# EAGLE design RedditSecretSanta2020_2 (EAGLE 9.6.2)
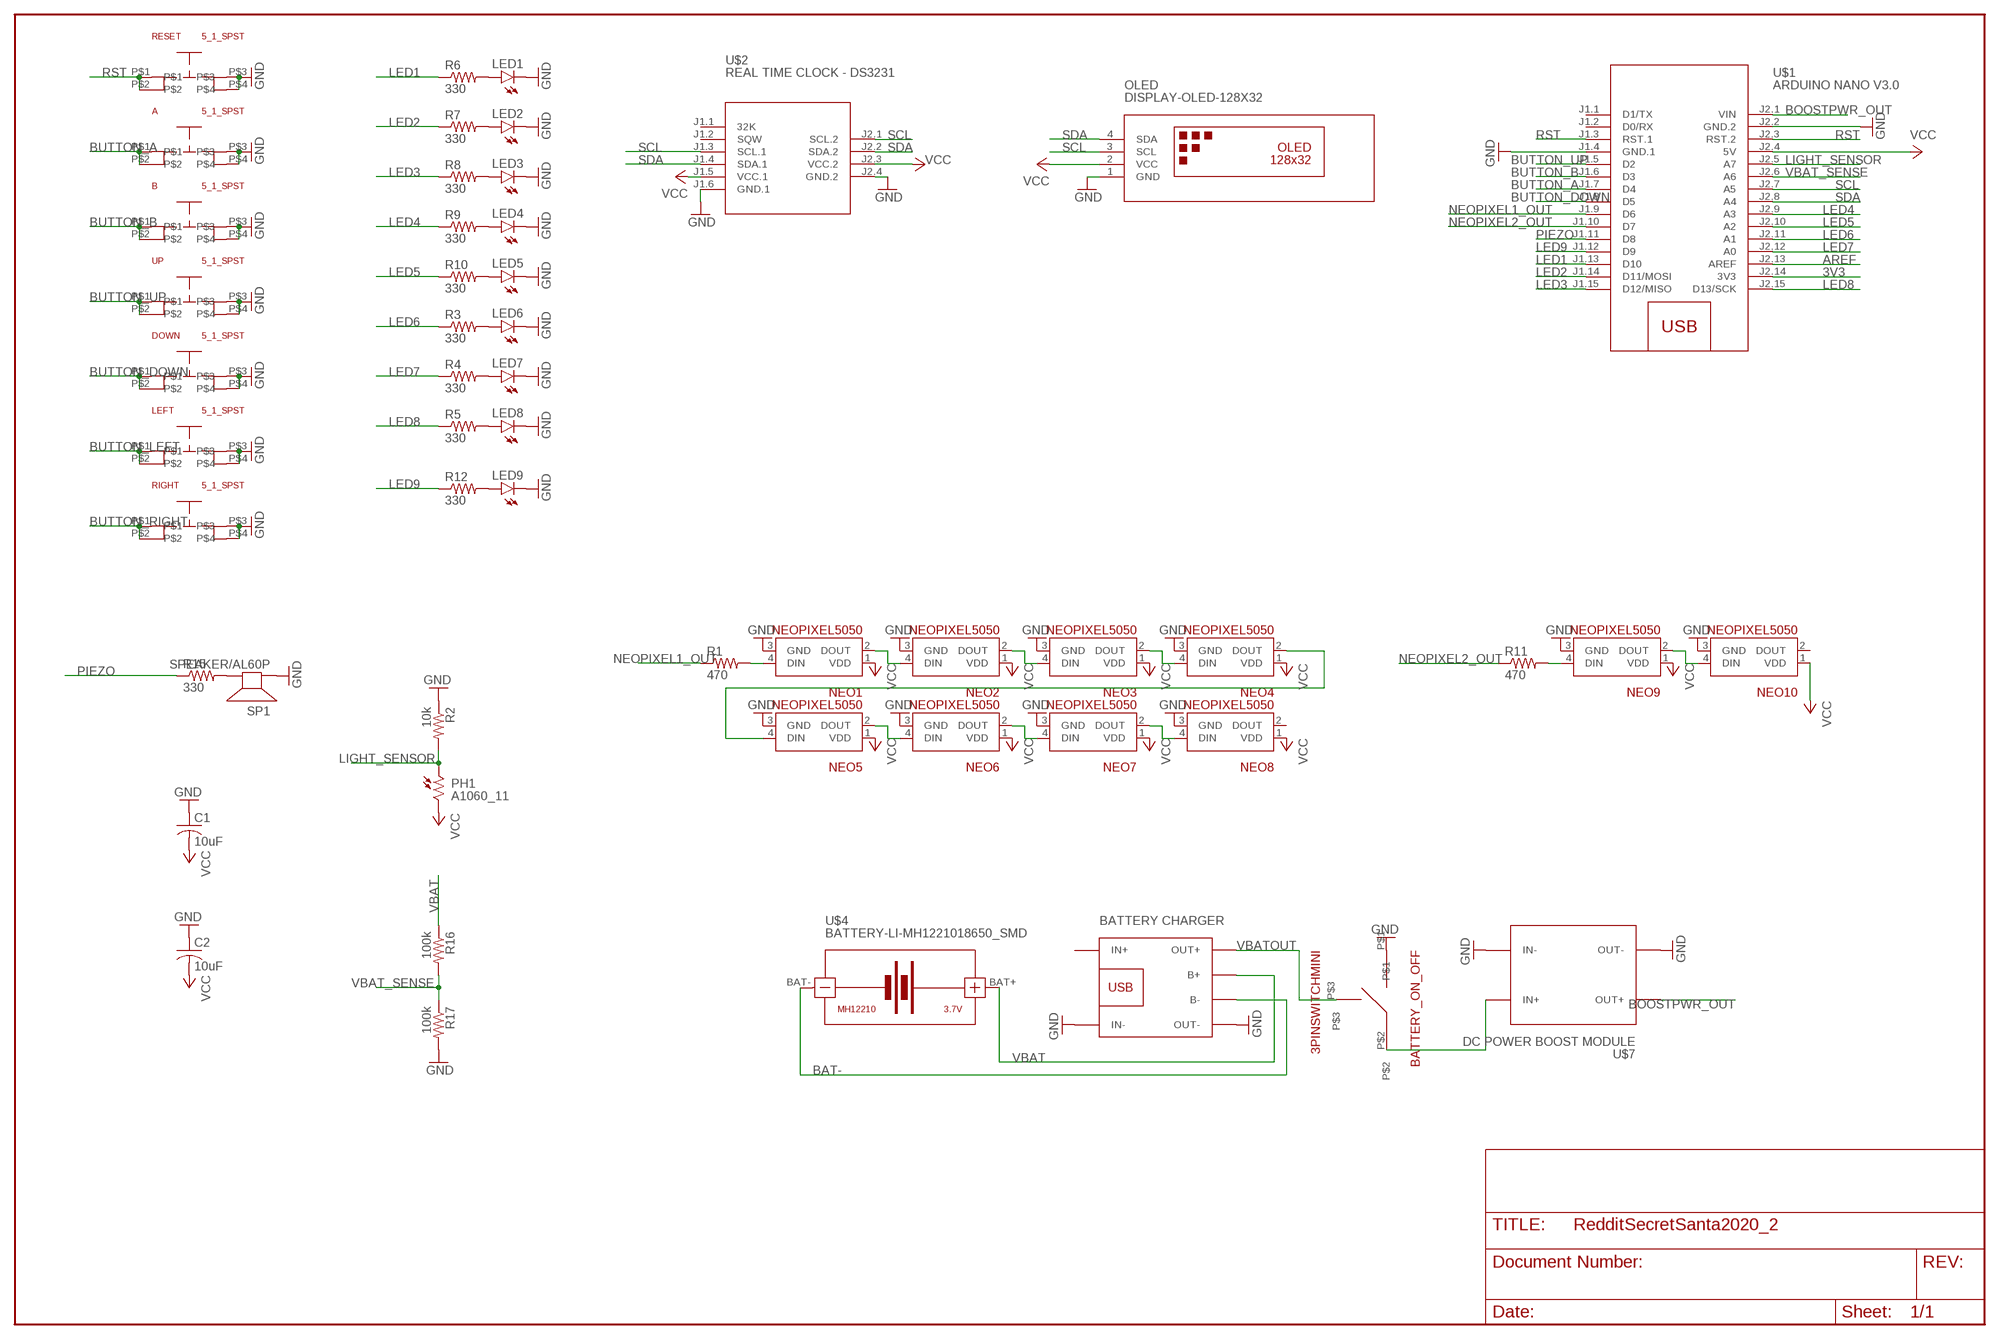
[diagram p0: schematic, sheet 1]

## Parts
A  5_1_SPST  [5_1_SPST]
B  5_1_SPST  [5_1_SPST]
BATTERY_ON_OFF  3PINSWITCHMINI  [3PINMINI]
C1  10uF  C-USC0805  [C0805]
C2  10uF  C-USC0805  [C0805]
DOWN  5_1_SPST  [5_1_SPST]
LED1  LEDSML0805  [SML0805]
LED2  LEDSML0805  [SML0805]
LED3  LEDSML0805  [SML0805]
LED4  LEDSML0805  [SML0805]
LED5  LEDSML0805  [SML0805]
LED6  LEDSML0805  [SML0805]
LED7  LEDSML0805  [SML0805]
LED8  LEDSML0805  [SML0805]
LED9  LEDSML0805  [SML0805]
LEFT  5_1_SPST  [5_1_SPST]
NEO1  NEOPIXEL5050  [NEOPIXEL5050]
NEO2  NEOPIXEL5050  [NEOPIXEL5050]
NEO3  NEOPIXEL5050  [NEOPIXEL5050]
NEO4  NEOPIXEL5050  [NEOPIXEL5050]
NEO5  NEOPIXEL5050  [NEOPIXEL5050]
NEO6  NEOPIXEL5050  [NEOPIXEL5050]
NEO7  NEOPIXEL5050  [NEOPIXEL5050]
NEO8  NEOPIXEL5050  [NEOPIXEL5050]
NEO9  NEOPIXEL5050  [NEOPIXEL5050]
NEO10  NEOPIXEL5050  [NEOPIXEL5050]
OLED  DISPLAY-OLED-128X32  [DISPLAY-OLED-128X32]
PH1  A1060_11  [T0-46-A10XX]
R1  470  R-US_R0805  [R0805]
R2  10k  R-US_R0805  [R0805]
R3  330  R-US_R0805  [R0805]
R4  330  R-US_R0805  [R0805]
R5  330  R-US_R0805  [R0805]
R6  330  R-US_R0805  [R0805]
R7  330  R-US_R0805  [R0805]
R8  330  R-US_R0805  [R0805]
R9  330  R-US_R0805  [R0805]
R10  330  R-US_R0805  [R0805]
R11  470  R-US_R0805  [R0805]
R12  330  R-US_R0805  [R0805]
R15  330  R-US_R0805  [R0805]
R16  100k  R-US_R0805  [R0805]
R17  100k  R-US_R0805  [R0805]
RESET  5_1_SPST  [5_1_SPST]
RIGHT  5_1_SPST  [5_1_SPST]
SP1  SPEAKER/AL60P  [AL60P]
U$1  ARDUINO NANO V3.0  ARDUINO-NANO-3.0  [ARDUINO-NANO-3.0]
U$2  REAL TIME CLOCK - DS3231  RTC-DS3231-AT24C32  [RTC-DS3231-AT24C32]
U$4  BATTERY-LI-MH1221018650_SMD  [BATTERY_18650_SMD]
U$6  BATTERY CHARGER  BATTERY-CHARGER-LI-PROTLOW_FP  [BAT_CHARGE_LOW_FP]
U$7  DC POWER BOOST MODULE  DC-DC-STEP-UP-MT3608LOW_FP  [DC-DC-STEP-UP-LOW_FP]
UP  5_1_SPST  [5_1_SPST]

## Nets
3V3 [PWR]: U$1.J2.14(3V3)
AREF [PWR]: U$1.J2.13(AREF)
BAT- [PWR]: U$4.BAT- U$6.B-
BOOSTPWR_OUT [PWR]: U$1.J2.1(VIN) U$7.OUT+
BUTTON_A: A.P$1 A.P$2 U$1.J1.7(D4)
BUTTON_B: B.P$1 B.P$2 U$1.J1.6(D3)
BUTTON_DOWN: DOWN.P$1 DOWN.P$2 U$1.J1.8(D5)
BUTTON_LEFT: LEFT.P$1 LEFT.P$2
BUTTON_RIGHT: RIGHT.P$1 RIGHT.P$2
BUTTON_UP: U$1.J1.5(D2) UP.P$1 UP.P$2
GND [GND]: A.P$3 A.P$4 B.P$3 B.P$4 BATTERY_ON_OFF.P$1 C1.1 C2.1 DOWN.P$3 DOWN.P$4 LED1.C LED2.C LED3.C LED4.C LED5.C LED6.C LED7.C LED8.C LED9.C LEFT.P$3 LEFT.P$4 NEO1.3(GND) NEO2.3(GND) NEO3.3(GND) NEO4.3(GND) NEO5.3(GND) NEO6.3(GND) NEO7.3(GND) NEO8.3(GND) NEO9.3(GND) NEO10.3(GND) OLED.1(GND) R2.1 R17.2 RESET.P$3 RESET.P$4 RIGHT.P$3 RIGHT.P$4 SP1.1(+) U$1.J1.4(GND.1) U$1.J2.2(GND.2) U$2.J1.6(GND.1) U$2.J2.4(GND.2) U$6.IN- U$6.OUT- U$7.IN- U$7.OUT- UP.P$3 UP.P$4
LED1: R6.1 U$1.J1.13(D10)
LED1W: LED1.A R6.2
LED1W1: LED6.A R3.2
LED2: R7.1 U$1.J1.14(D11/MOSI)
LED2W: LED2.A R7.2
LED2W1: LED7.A R4.2
LED3: R8.1 U$1.J1.15(D12/MISO)
LED3W: LED3.A R8.2
LED3W1: LED8.A R5.2
LED3W2: LED9.A R12.2
LED4: R9.1 U$1.J2.9(A3)
LED4W: LED4.A R9.2
LED5: R10.1 U$1.J2.10(A2)
LED5W: LED5.A R10.2
LED6: R3.1 U$1.J2.11(A1)
LED7: R4.1 U$1.J2.12(A0)
LED8: R5.1 U$1.J2.15(D13/SCK)
LED9: R12.1 U$1.J1.12(D9)
LIGHT_SENSOR: PH1.1 R2.2 U$1.J2.5(A7)
N$3: NEO9.4(DIN) R11.2
N$6: R15.2 SP1.2(-)
N$8: NEO4.2(DOUT) NEO5.4(DIN)
N$12: NEO1.4(DIN) R1.2
N$18: NEO1.2(DOUT) NEO2.4(DIN)
N$20: NEO2.2(DOUT) NEO3.4(DIN)
N$21: NEO3.2(DOUT) NEO4.4(DIN)
N$23: NEO5.2(DOUT) NEO6.4(DIN)
N$24: NEO6.2(DOUT) NEO7.4(DIN)
N$25: NEO7.2(DOUT) NEO8.4(DIN)
N$27: NEO9.2(DOUT) NEO10.4(DIN)
NEOPIXEL1_OUT: R1.1 U$1.J1.9(D6)
NEOPIXEL2_OUT: R11.1 U$1.J1.10(D7)
PIEZO: R15.1 U$1.J1.11(D8)
RST: RESET.P$1 RESET.P$2 U$1.J1.3(RST.1) U$1.J2.3(RST.2)
SCL: OLED.3(SCL) U$1.J2.7(A5) U$2.J1.3(SCL.1) U$2.J2.1(SCL.2)
SDA: OLED.4(SDA) U$1.J2.8(A4) U$2.J1.4(SDA.1) U$2.J2.2(SDA.2)
VBAT [PWR]: R16.1 U$4.BAT+ U$6.B+
VBAT_SENSE: R16.2 R17.1 U$1.J2.6(A6)
VBATOUT [PWR]: BATTERY_ON_OFF.P$3 U$6.OUT+
VBOOST_IN [PWR]: BATTERY_ON_OFF.P$2 U$7.IN+
VCC [PWR]: C1.2 C2.2 NEO1.1(VDD) NEO2.1(VDD) NEO3.1(VDD) NEO4.1(VDD) NEO5.1(VDD) NEO6.1(VDD) NEO7.1(VDD) NEO8.1(VDD) NEO9.1(VDD) NEO10.1(VDD) OLED.2(VCC) PH1.2 U$1.J2.4(5V) U$2.J1.5(VCC.1) U$2.J2.3(VCC.2)
Unconnected: NEO8.2(DOUT) NEO10.2(DOUT) U$1.J1.1(D1/TX) U$1.J1.2(D0/RX) U$2.J1.1(32K) U$2.J1.2(SQW) U$6.IN+

## Library data of the parts
A B DOWN LEFT RESET RIGHT UP = TrophyParts:5_1_SPST
BATTERY_ON_OFF = TrophyParts:3PINSWITCHMINI
C1 C2 = rcl:C-US: CAPACITOR, American symbol; SPICEPREFIX: C
LED1-LED9 = led:LED: LED OSRAM: - CHIPLED LG R971, LG N971, LY N971, LG Q971, LY Q971, LO R971, LY R971 LH N974, LH R974 LS Q976, LO Q976, LY Q976 LO Q996 - Hyper CHIPLED LW Q18S LB Q993, LB Q99A, LB R99A - SideLED LS A670, LO A670, LY A670, LG A670, LP A670 LB A673, LV A673, LT A673, LW A673 LH A674 LY A675 LS A676, LA A676, LO A676, LY A676, LW A676 LS A679, LY A679, LG A679 - Hyper Micro SIDELED® LS Y876, LA Y876, LO Y876, LY Y876 LT Y87S - SmartLED LW L88C, LW L88S LB L89C, LB L89S, LG L890 LS L89K, LO L89K, LY L89K LS L896, LA L896, LO L896, LY L896 - TOPLED LS T670, LO T670, LY T670, LG T670, LP T670 LSG T670, LSP T670, LSY T670, LOP T670, LYG T670 LG T671, LOG T671, LSG T671 LB T673, LV T673, LT T673, LW T673 LH T674 LS T676, LA T676, LO T676, LY T676, LB T676, LH T676, LSB T676, LW T676 LB T67C, LV T67C, LT T67C, LS T67K, LO T67K, LY T67K, LW E67C LS E67B, LA E67B, LO E67B, LY E67B, LB E67C, LV E67C, LT E67C LW T67C LS T679, LY T679, LG T679 LS T770, LO T770, LY T770, LG T770, LP T770 LB T773, LV T773, LT T773, LW T773 LH T774 LS E675, LA E675, LY E675, LS T675 LS T776, LA T776, LO T776, LY T776, LB T776 LHGB T686 LT T68C, LB T68C - Hyper Mini TOPLED® LB M676 - Mini TOPLED Santana® LG M470 LS M47K, LO M47K, LY M47K Source: http://www.osram.convergy.de LUXEON: - LUMILED® LXK2-PW12-R00, LXK2-PW12-S00, LXK2-PW14-U00, LXK2-PW14-V00 LXK2-PM12-R00, LXK2-PM12-S00, LXK2-PM14-U00 LXK2-PE12-Q00, LXK2-PE12-R00, LXK2-PE12-S00, LXK2-PE14-T00, LXK2-PE14-U00 LXK2-PB12-K00, LXK2-PB12-L00, LXK2-PB12-M00, LXK2-PB14-N00, LXK2-PB14-P00, LXK2-PB14-Q00 LXK2-PR12-L00, LXK2-PR12-M00, LXK2-PR14-Q00, LXK2-PR14-R00 LXK2-PD12-Q00, LXK2-PD12-R00, LXK2-PD12-S00 LXK2-PH12-R00, LXK2-PH12-S00 LXK2-PL12-P00, LXK2-PL12-Q00, LXK2-PL12-R00 Source: www.luxeon.com KINGBRIGHT: KA-3528ASYC Source: www.kingbright.com
NEO1-NEO10 = TrophyParts:NEOPIXEL5050
OLED = Hatch2020:DISPLAY-OLED-128X32: 128x32 Dot Matrix OLED Module with I2C interface based on SSD1306 chip More details available here: http://www.tinyosshop.com/index.php?route=product/product&product_id=953 Schematic available here: http://www.tinyosshop.com/datasheet/OLED%2012832.pdf SSD1306 datasheet: https://cdn-shop.adafruit.com/datasheets/SSD1306.pdf Click here to find device on ebay.com <http://www.ebay.com/sch/oled+display+128x32+i2c>
PH1 = photo-elements:A10: Sensor Robust Light Sensing Applications Outdoor Light Sensing Application Source: http://optoelectronics.perkinelmer.com/content/Datasheets/DTS_PhotocellsA1050.pdf
R1-R12 R15-R17 = rcl:R-US_: RESISTOR, American symbol; SPICEPREFIX: R
SP1 = adafruit:SPEAKER: SPEAKER Source: Buerklin Added PS12 (for part # PS1240 piezo) http://www.ladyada.net/library/pcb/eaglelibrary.html
U$1 = diy-modules:ARDUINO-NANO-3.0: Arduino Nano 3.0 and compatible devices More details available here: https://www.arduino.cc/en/Main/ArduinoBoardNano Click here to find device on ebay.com <http://www.ebay.com/sch/arduino+nano>
U$2 = Hatch2020:RTC-DS3231-AT24C32: RTC Module with Battery and EEPROM based on DS3231 and AT24C32 chips Tutorial can be found here: https://edwardmallon.wordpress.com/2014/05/21/using-a-cheap-3-ds3231-rtc-at24c32-eeprom-from-ebay/ Click here to find device on ebay.com <http://www.ebay.com/sch/DS3231+AT24C32+module>
U$4 = Hatch2020:BATTERY-LI-MH12210: Lithium-Ion MH12210 Rechargeable Battery Panasonic NCR18650PF battery datasheet available here: https://industrial.panasonic.com/cdbs/www-data/pdf2/ACI4000/ACI4000C12.pdf Click here to find device on ebay.com <http://www.ebay.com/sch/ncr18650b+battery>
U$6 = Hatch2020:BATTERY-CHARGER-LI-PROT: Lithium Battery 5V Charger with protection circuit More details available here: http://www.instructables.com/id/DIY-Lithium-ion-Battery-Charger/step4/TP4056-based-lithium-ion-battery-charger-module/ Click here to find device on ebay.com <http://www.ebay.com/sch/tp4056+charger+usb+protection>
U$7 = Hatch2020:DC-DC-STEP-UP-MT3608: DC/DC Step-Up Regulator based on MT3608 chip MT3608 datasheet available here: https://www.olimex.com/Products/Breadboarding/BB-PWR-3608/resources/MT3608.pdf Click here to find device on ebay.com <http://www.ebay.com/sch/mt3608+module>

## Net classes
1 PWR: width 0.508 mm
3 GND: width 0.254 mm

## Board
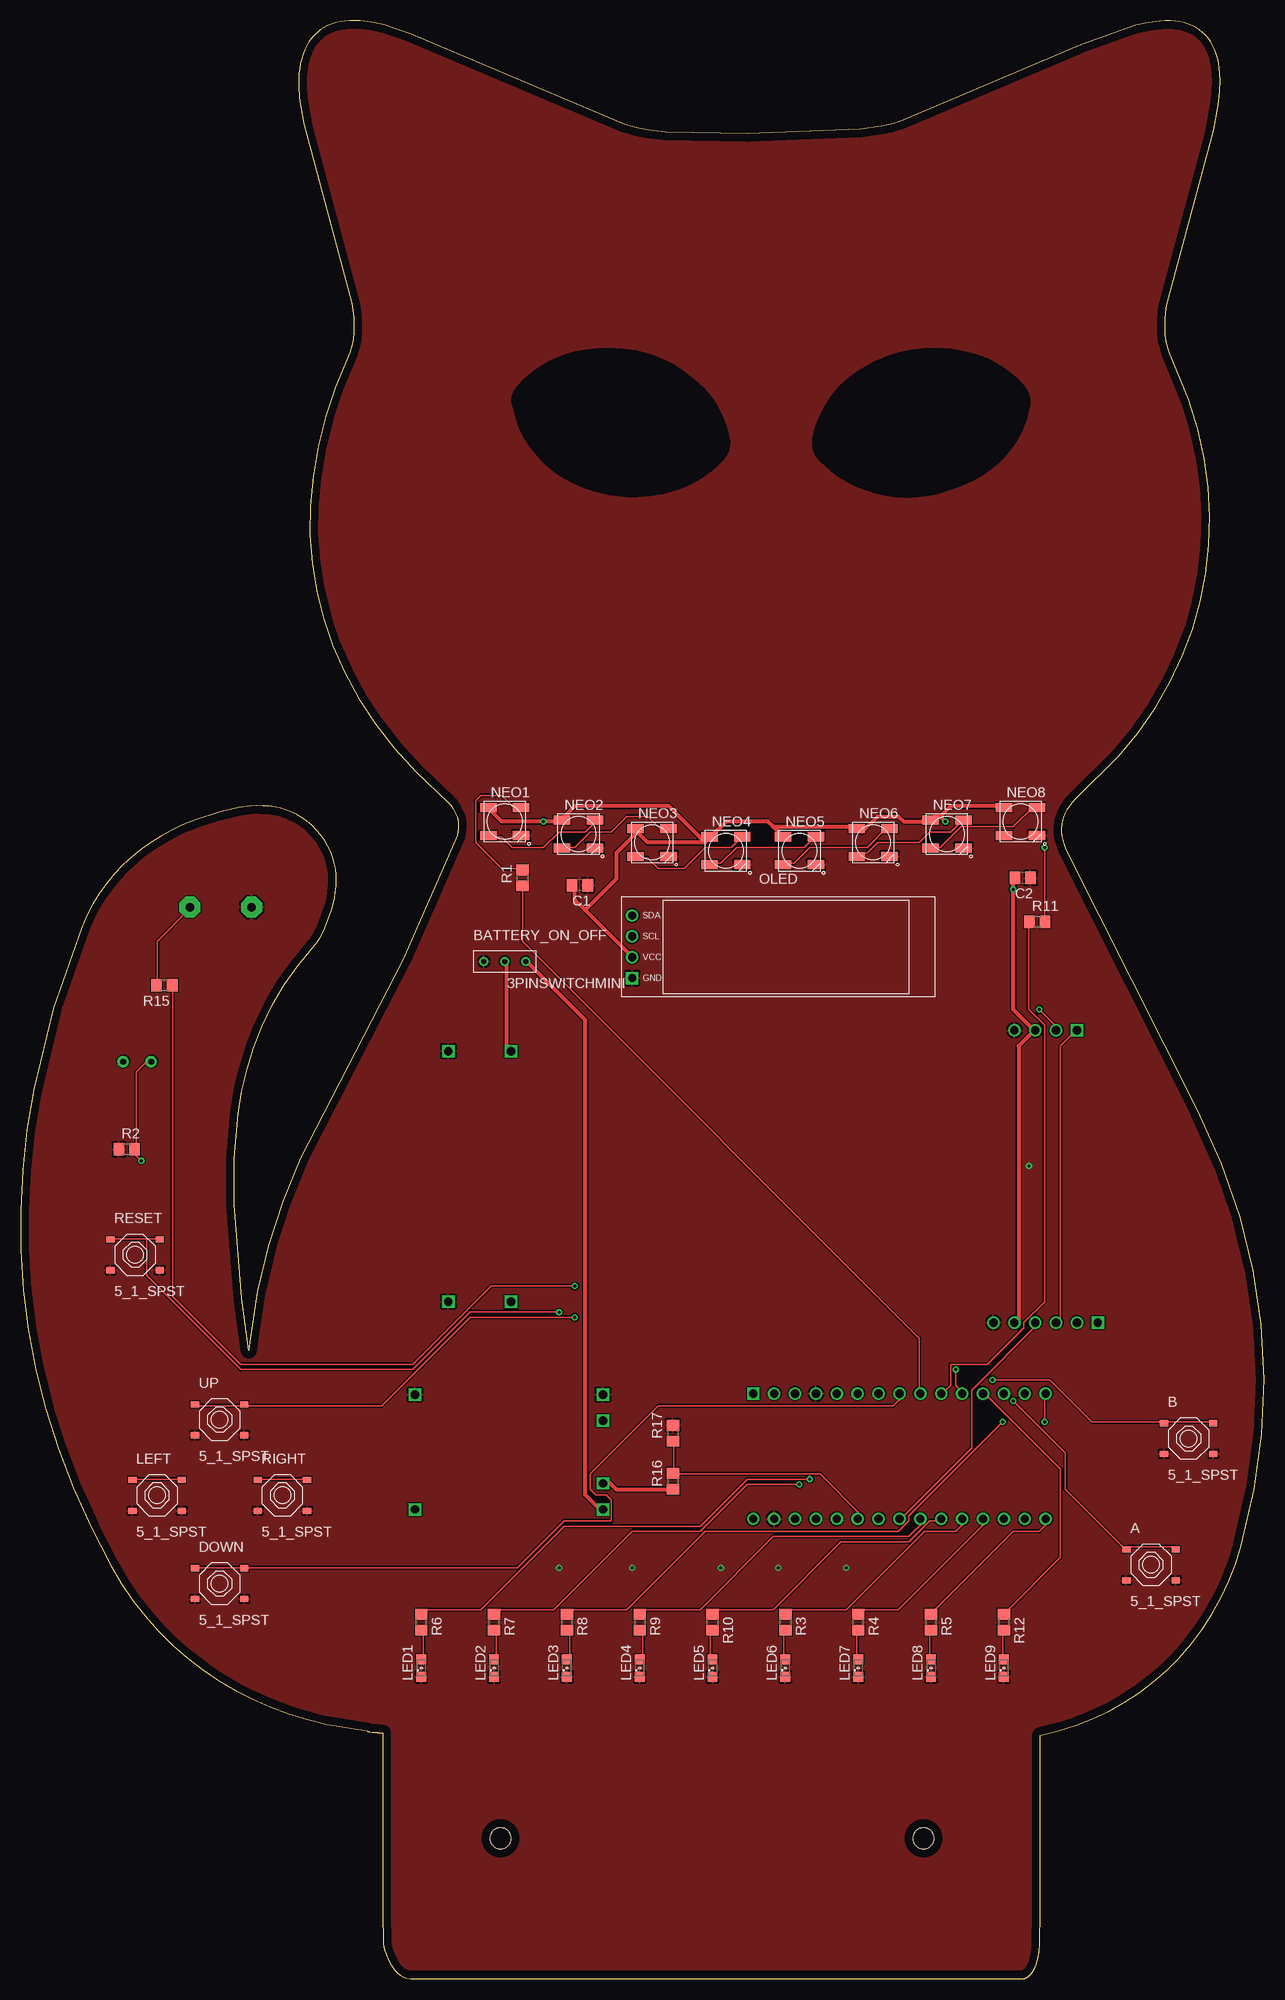
[diagram p1: board, top side]
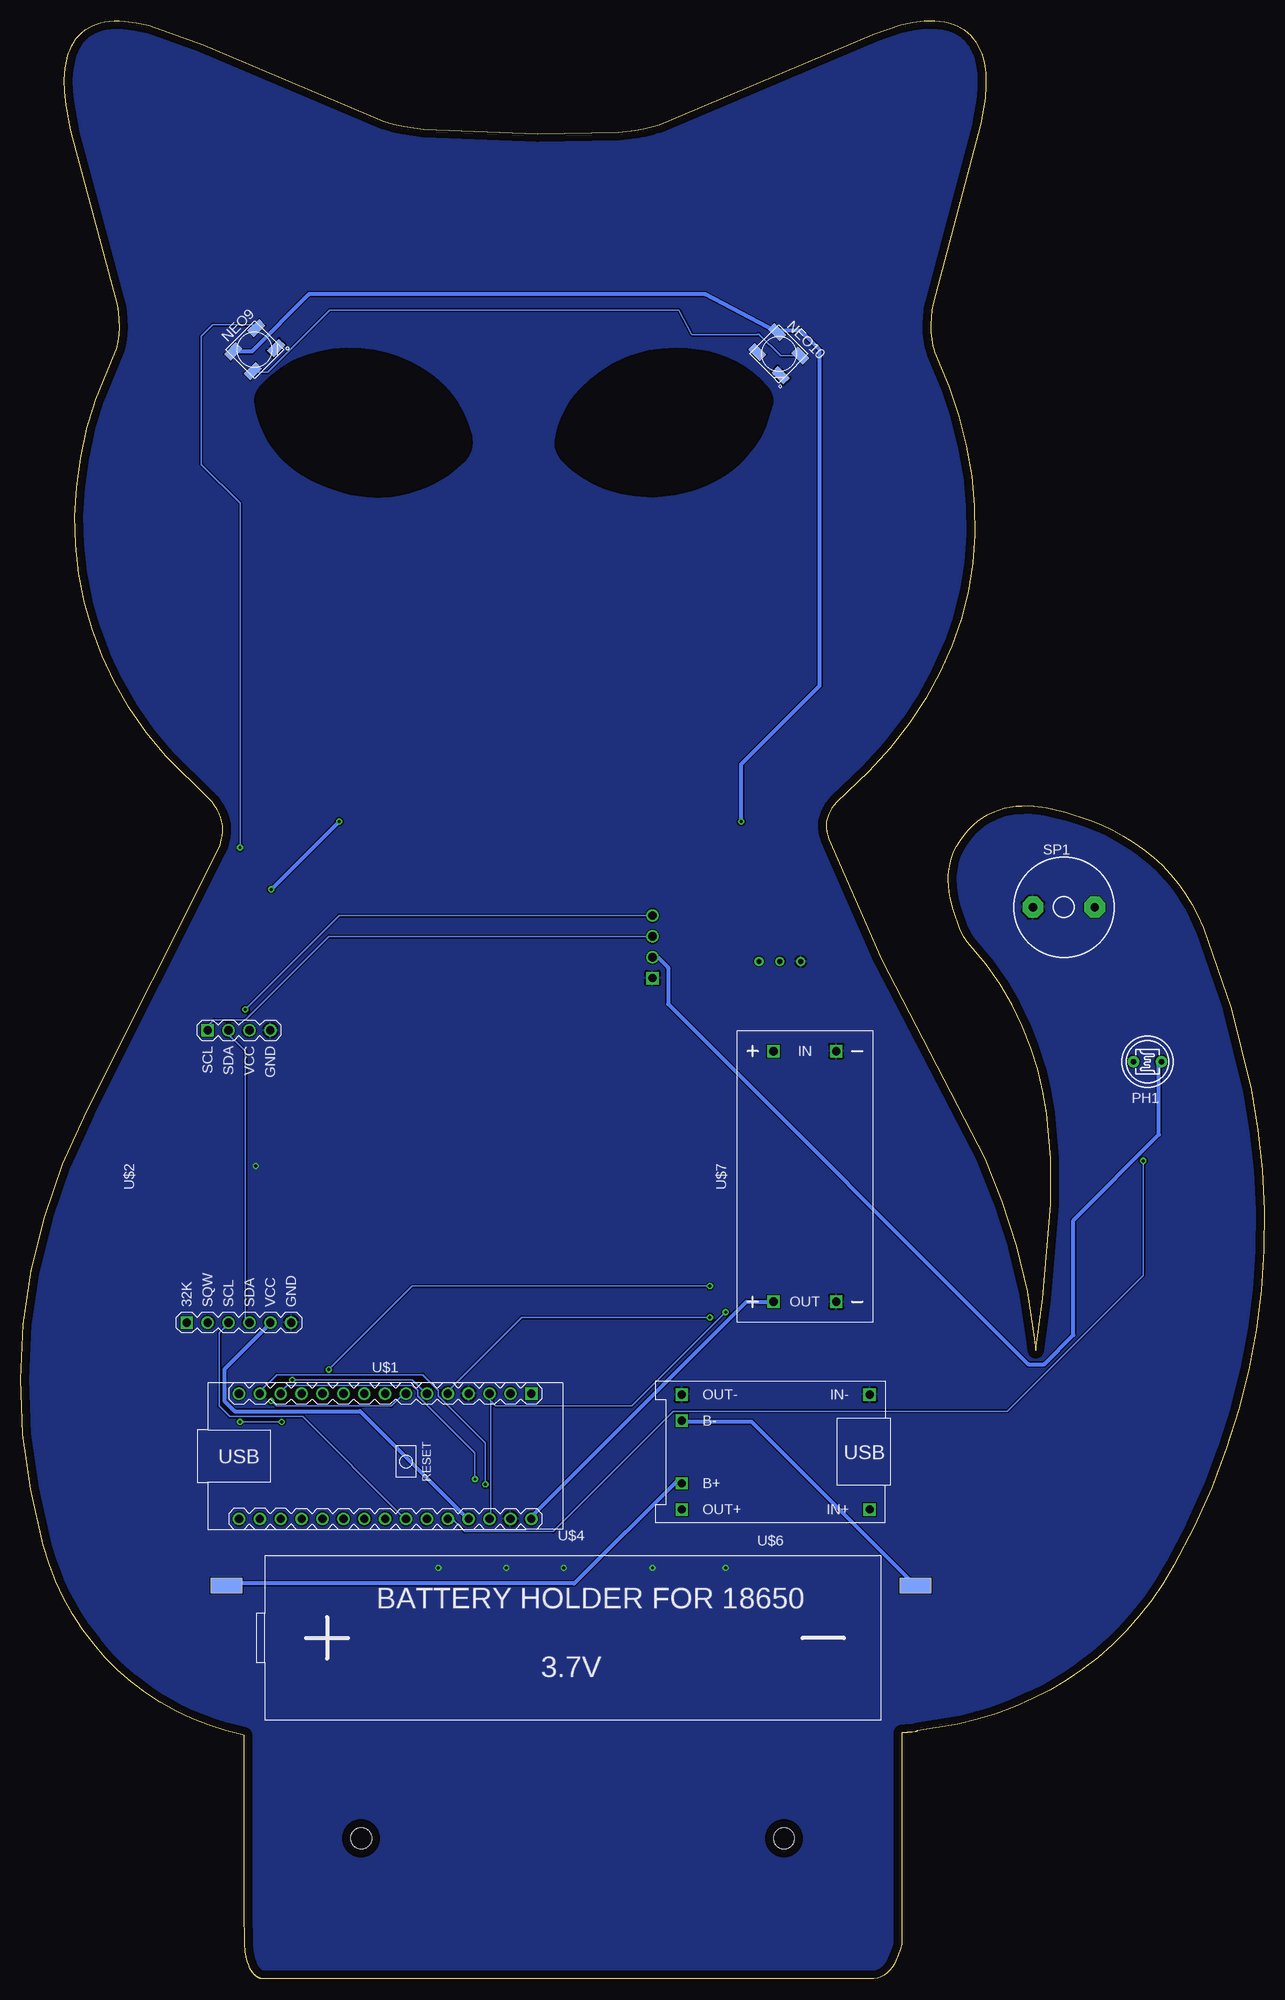
[diagram p2: board, bottom side, seen from below]

Size 151.25 x 238.26 mm. Coordinates in mm from the lower left corner, seen from the top.
Outline: 121.89,0 121.88,0 121.88,0 121.88,0 121.88,0 121.88,0 121.88,0 121.87,0 121.87,0 121.87,0 121.87,0 121.86,0 121.86,0 121.86,0 121.85,0 121.85,0 47.45,0 46.98,0.08 46.56,0.24 46.18,0.47 45.83,0.75 45.52,1.07 45.25,1.43 45.01,1.81 44.8,2.19 44.47,2.94 44.25,3.59 44.09,4.22 44.08,8.31 44.06,8.31 44.05,29.96 43.44,29.96 43.44,29.98 43.1,29.98 42.95,29.99 42.94,29.99 42.93,29.99 42.92,29.99 42.77,30 42.45,30.07 42.44,30.07 42.43,30.07 42.43,30.07 42.42,30.08 42.42,30.08 42.41,30.08 42.4,30.08 42.39,30.09 42.39,30.09 42.38,30.09 42.37,30.1 42.36,30.1 42.36,30.1 42.35,30.1 42.34,30.11 42.33,30.11 42.33,30.11 42.32,30.11 42.32,30.11 42.31,30.12 42.3,30.12 42.29,30.12 42.28,30.13 42.27,30.13 42.27,30.13 42.26,30.13 42.26,30.14 42.25,30.14 42.24,30.14 42.23,30.14 42.22,30.15 42.21,30.15 42.21,30.15 42.2,30.15 42.2,30.16 42.19,30.16 42.18,30.16 42.17,30.16 42.17,30.17 42.16,30.17 42.15,30.17 37.26,30.98 34.89,31.57 32.59,32.28 30.35,33.1 28.18,34.05 26.08,35.13 24.06,36.32 22.11,37.64 20.25,39.08 18.47,40.65 16.78,42.33 15.18,44.15 13.67,46.09 12.26,48.16 10.96,50.35 8.52,55.04 6.39,59.77 4.58,64.53 3.07,69.3 1.87,74.11 0.96,78.93 0.35,83.78 0.03,88.64 0,93.52 0.25,98.41 0.78,103.31 1.58,108.22 3.98,118.07 7.43,127.93 8.07,129.38 8.79,130.75 9.58,132.05 10.46,133.27 11.4,134.42 12.41,135.49 13.5,136.5 14.64,137.42 15.85,138.28 17.11,139.07 18.43,139.79 19.8,140.43 21.22,141.01 24.2,141.97 26.51,142.5 28.01,142.69 28.75,142.73 29.48,142.72 30.2,142.67 30.91,142.58 31.6,142.43 32.28,142.23 32.94,141.97 33.59,141.66 34.21,141.29 34.82,140.86 35.4,140.36 35.96,139.8 36.5,139.17 36.98,138.5 37.38,137.82 37.72,137.14 37.98,136.45 38.17,135.76 38.31,135.06 38.39,134.36 38.41,133.65 38.38,132.94 38.3,132.23 38.19,131.52 37.83,130.09 37.01,127.79 36.75,127.23 36.45,126.68 36.1,126.17 33.82,123.42 32.1,120.98 30.62,118.48 29.38,115.93 28.36,113.34 27.54,110.7 26.91,108.03 26.45,105.32 25.97,99.81 25.97,94.21 26.91,82.8 27.78,76.46 27.92,77.93 28.81,83.66 30.16,89.2 31.9,94.57 33.99,99.8 46.47,123.96 52.94,138.65 53.1,139.13 53.2,139.58 53.25,140.01 53.26,140.21 53.26,140.42 53.25,140.62 53.23,140.81 53.2,141 53.15,141.19 53.1,141.38 52.96,141.74 52.78,142.1 52.56,142.44 52.3,142.79 52.01,143.13 48.06,146.92 45.47,149.76 43.16,152.71 41.15,155.76 39.42,158.9 37.99,162.13 36.85,165.43 36.01,168.8 35.46,172.24 35.2,175.73 35.24,179.27 35.57,182.86 36.21,186.48 37.14,190.13 38.36,193.8 40.04,197.86 40.18,198.25 40.29,198.65 40.45,199.49 40.53,200.37 40.55,201.26 40.5,202.16 40.4,203.04 40.25,203.89 34.44,225.7 33.92,228.81 33.83,230.35 33.87,231.76 33.94,232.42 34.04,233.04 34.18,233.63 34.35,234.19 34.56,234.71 34.8,235.2 35.06,235.65 35.36,236.07 35.7,236.45 36.06,236.8 36.45,237.11 36.88,237.38 37.33,237.62 37.81,237.82 38.33,237.98 38.87,238.11 39.44,238.2 40.04,238.24 40.66,238.26 41.32,238.23 42.71,238.05 44.2,237.72 47.54,236.6 73.54,225.61 74.48,225.31 75.46,225.08 76.46,224.9 78.49,224.68 88.37,224.51 102.19,225.05 104.67,225.4 105.87,225.67 107.04,226.02 129.01,235.32 135.65,237.67 137.16,238 138.56,238.18 139.22,238.22 139.84,238.21 140.44,238.16 141.01,238.08 141.54,237.96 142.05,237.8 142.53,237.61 142.97,237.38 143.39,237.11 143.77,236.8 144.13,236.46 144.45,236.08 144.74,235.67 145,235.21 145.23,234.73 145.42,234.21 145.58,233.65 145.71,233.06 145.81,232.43 145.9,231.08 145.86,229.59 145.69,227.96 145.13,224.93 139.42,203.62 139.29,202.75 139.21,201.85 139.2,200.94 139.25,200.04 139.37,199.17 139.57,198.33 139.7,197.94 142.1,192.12 143.17,188.59 143.95,185.05 144.44,181.5 144.64,177.97 144.54,174.46 144.16,170.99 143.5,167.57 142.55,164.21 141.31,160.92 139.8,157.73 138,154.63 135.93,151.65 133.58,148.8 128.34,143.62 127.95,143.16 127.61,142.7 127.32,142.24 127.08,141.78 126.89,141.31 126.82,141.07 126.76,140.83 126.71,140.59 126.67,140.34 126.65,140.1 126.65,139.85 126.65,139.59 126.71,139.07 126.82,138.53 126.98,137.97 127.2,137.39 143.22,105.53 146.09,99.15 148.33,92.7 149.94,86.18 150.91,79.61 151.25,72.97 150.95,66.28 150.02,59.53 148.47,52.74 147.77,50.51 146.94,48.37 145.98,46.32 144.9,44.36 143.69,42.5 142.37,40.75 140.94,39.1 139.41,37.56 137.77,36.13 136.05,34.82 134.24,33.63 132.34,32.57 130.37,31.64 128.32,30.83 126.21,30.17 124.04,29.64 124.05,8.31 124.04,8.31 123.97,4.27 123.89,3.31 123.79,2.7 123.66,2.16 123.52,1.72 123.35,1.33 123.18,1.01 123.17,1 123.17,0.99 123.16,0.98 123.15,0.97 123.14,0.95 123.13,0.95 123.12,0.93 123.12,0.92 123.11,0.9 123.1,0.89 123.09,0.88 123.08,0.87 123.07,0.85 123.07,0.85 123.05,0.83 123.05,0.82 123.04,0.8 123.03,0.8 123.02,0.78 123.01,0.77 123,0.75 123,0.75 122.99,0.74 122.98,0.73 122.98,0.72 122.97,0.72 122.81,0.53 122.8,0.52 122.79,0.51 122.79,0.51 122.78,0.5 122.77,0.49 122.75,0.48 122.75,0.47 122.74,0.46 122.73,0.46 122.72,0.44 122.71,0.44 122.7,0.43 122.7,0.42 122.68,0.41 122.68,0.41 122.67,0.4 122.66,0.39 122.65,0.38 122.64,0.38 122.63,0.37 122.63,0.36 122.62,0.36 122.62,0.36 122.59,0.34 122.59,0.33 122.58,0.33 122.58,0.32 122.57,0.32 122.57,0.32 122.54,0.3 122.53,0.29 122.51,0.27 122.5,0.27 122.5,0.26 122.49,0.26 122.48,0.26 122.48,0.25 122.45,0.23 122.44,0.23 122.44,0.22 122.43,0.22 122.43,0.22 122.43,0.22 122.42,0.22 122.42,0.21 122.42,0.21 122.41,0.21 122.41,0.21 122.4,0.2 122.4,0.2 122.4,0.2 122.39,0.2 122.39,0.19 122.39,0.19 122.38,0.19 122.38,0.19 122.37,0.19 122.37,0.18 122.37,0.18 122.36,0.18 122.36,0.18 122.36,0.18 122.35,0.17 122.35,0.17 122.34,0.17 122.34,0.17 122.34,0.16 122.33,0.16 122.33,0.16 122.33,0.16 122.32,0.15 122.32,0.15 122.31,0.15 122.31,0.15 122.31,0.15 122.3,0.15 122.3,0.14 122.3,0.14 122.29,0.14 122.29,0.14 122.28,0.13 122.28,0.13 122.27,0.13 122.27,0.13 122.27,0.13 122.26,0.13 122.26,0.13 122.26,0.12 122.25,0.12 122.25,0.12 122.24,0.12 122.24,0.12 122.24,0.11 122.24,0.11 122.23,0.11 122.23,0.11 122.23,0.11 122.22,0.11 122.22,0.11 122.22,0.11 122.21,0.1 122.21,0.1 122.21,0.1 122.2,0.1 122.2,0.1 122.2,0.1 122.19,0.1 122.19,0.09 122.19,0.09 122.19,0.09 122.18,0.09 122.18,0.09 122.17,0.09 122.17,0.08 122.16,0.08 122.16,0.08 122.15,0.08 122.15,0.08 122.15,0.07 122.15,0.07 122.14,0.07 122.14,0.07 122.14,0.07 122.13,0.07 122.13,0.07 122.13,0.07 122.12,0.07 122.12,0.06 122.11,0.06 122.11,0.06 122.11,0.06 122.1,0.06 122.1,0.06 122.1,0.06 122.09,0.06 122.09,0.06 122.09,0.05 122.08,0.05 122.08,0.05 122.08,0.05 122.08,0.05 122.07,0.05 122.07,0.05 122.07,0.05 122.06,0.05 122.06,0.04 122.06,0.04 122.05,0.04 122.05,0.04 122.04,0.04 122.04,0.04 122.04,0.04 122.03,0.04 122.03,0.03 122.02,0.03 122.02,0.03 122.02,0.03 122.02,0.03 121.93,0.01 121.93,0.01 121.93,0.01 121.93,0.01 121.92,0.01 121.92,0.01 121.92,0.01 121.92,0.01 121.92,0.01 121.92,0.01 121.91,0.01
Outline: 121.89,0 121.89,0
Outline: 121.89,0 121.89,0 121.89,0 121.89,0.01 121.89,0.01 121.89,0.01 121.9,0.01 121.9,0.01 121.9,0.01 121.9,0.01 121.91,0.01 121.91,0.01 121.91,0.01 121.91,0.01 121.91,0.01 121.91,0.01
Outline: 121.91,0.01 121.91,0.01
Copper layers (1*16): Top 0.035mm / dielectric 1.5mm / Bottom 0.035mm
Design rules "default": minimum track width 6mil, minimum drill 0.35mm, track to track 6mil, track to pad 6mil, pad to pad 6mil, via to via 6mil, smd to smd 6mil, copper to edge 40mil, drill to drill 6mil, minimum pad ring 10mil, minimum via ring 8mil, stop-mask expansion 4mil, vias tented up to drill 0mil, thermal gap 10mil
Holes 2.54 mm at 58.39,17.11 109.82,17.11
tRestrict: area 76.4,181.2 to 85.6,197.1; area 60.4,181.1 to 76.4,197.9; area 97,181.1 to 106.4,197.2; area 106.4,181 to 122.1,197.9; area 59.7,180.2 to 86.3,198.4; area 96.3,180.2 to 122.8,198.5
bRestrict: area 76.4,181.2 to 85.6,197.1; area 60.4,181.1 to 76.4,197.9; area 97,181.1 to 106.4,197.2; area 106.4,181 to 122.1,197.9; area 59.7,180.2 to 86.3,198.4; area 96.3,180.2 to 122.8,198.5
vRestrict: area 59.7,180.4 to 86.8,198.7; area 96,179.9 to 123.4,199.2

### Footprints (pad centres in the part's own frame; a part is rotated, then mirrored left to right if it is on the bottom)
5_1_SPST = smd 1 x 0.75: P$1 -3,1.875; P$2 3,1.875; P$3 -3,-1.875; P$4 3,-1.875
3PINMINI = drill 0.6: P$1 1.27,3.81; P$2 3.81,3.81; P$3 6.35,3.81
C0805 = smd 1.3 x 1.5: 1 -0.95,0; 2 0.95,0
SML0805 = smd 1.2 x 1.2: A 1.05,0; C -1.05,0
NEOPIXEL5050 = smd 2 x 1.1: 1 -2,1.7; 2 -2,-1.7; 3 2,-1.7; 4 2,1.7
DISPLAY-OLED-128X32 = drill 1 square: 1 -17.78,-3.81 | drill 1: 2 -17.78,-1.27; 3 -17.78,1.27; 4 -17.78,3.81
T0-46-A10XX = drill 0.7 pad 1.4: 1 -1.7,0; 2 1.7,0
R0805 = smd 1.3 x 1.5: 1 -0.95,0; 2 0.95,0
AL60P = drill 1.016 pad 2.54 octagon: 1 -3.759,0; 2 3.759,0
ARDUINO-NANO-3.0 = drill 1 square: J1.1 17.78,7.62 | drill 1: J1.2 15.24,7.62; J1.3 12.7,7.62; J1.4 10.16,7.62; J1.5 7.62,7.62; J1.6 5.08,7.62; J1.7 2.54,7.62; J1.8 0,7.62; J1.9 -2.54,7.62; J1.10 -5.08,7.62; J1.11 -7.62,7.62; J1.12 -10.16,7.62; J1.13 -12.7,7.62; J1.14 -15.24,7.62; J1.15 -17.78,7.62; J2.1 17.78,-7.62; J2.2 15.24,-7.62; J2.3 12.7,-7.62; J2.4 10.16,-7.62; J2.5 7.62,-7.62; J2.6 5.08,-7.62; J2.7 2.54,-7.62; J2.8 0,-7.62; J2.9 -2.54,-7.62; J2.10 -5.08,-7.62; J2.11 -7.62,-7.62; J2.12 -10.16,-7.62; J2.13 -12.7,-7.62; J2.14 -15.24,-7.62; J2.15 -17.78,-7.62
RTC-DS3231-AT24C32 = drill 1 square: J1.1 -17.78,6.35; J2.1 17.78,3.81 | drill 1: J1.2 -17.78,3.81; J1.3 -17.78,1.27; J1.4 -17.78,-1.27; J1.5 -17.78,-3.81; J1.6 -17.78,-6.35; J2.2 17.78,1.27; J2.3 17.78,-1.27; J2.4 17.78,-3.81
BATTERY_18650_SMD = smd 3.81 x 1.93: BAT+ -40.64,6.35; BAT- 43.18,6.35
BAT_CHARGE_LOW_FP = drill 1 square: B+ 11.43,3.81; B- 11.43,-3.81; IN+ -11.43,6.985; IN- -11.43,-6.985; OUT+ 11.43,6.985; OUT- 11.43,-6.985
DC-DC-STEP-UP-LOW_FP = drill 1 square: IN+ 15.24,3.81; IN- 15.24,-3.81; OUT+ -15.24,3.81; OUT- -15.24,-3.81

### Placement (x,y rotation side)
A  137.51,50.39 0 top
B  142.08,65.75 0 top
BATTERY_ON_OFF  55.08,119.98 0 top
C1  68.04,133.06 180 top
C2  121.89,133.95 180 top
DOWN  24.22,48.1 0 top
LED1  48.73,37.81 90 top
LED2  57.59,37.81 90 top
LED3  66.45,37.81 90 top
LED4  75.31,37.81 90 top
LED5  84.17,37.81 90 top
LED6  93.02,37.81 90 top
LED7  101.88,37.81 90 top
LED8  110.74,37.81 90 top
LED9  119.6,37.81 90 top
LEFT  16.6,58.83 0 top
NEO1  58.89,140.81 0 top
NEO2  67.86,139.29 0 top
NEO3  76.82,138.27 0 top
NEO4  85.78,137.25 0 top
NEO5  94.74,137.25 0 top
NEO6  103.71,138.27 0 top
NEO7  112.67,139.29 0 top
NEO8  121.63,140.81 0 top
NEO9  122.77,198.21 45 bottom
NEO10  59.02,197.71 315 bottom
OLED  92.17,125.57 0 top
PH1  14.19,111.6 0 bottom
R1  61.05,133.95 90 top
R2  12.92,100.93 0 top
R3  93.02,43.4 270 top
R4  101.88,43.4 270 top
R5  110.74,43.4 270 top
R6  48.73,43.4 270 top
R7  57.59,43.4 270 top
R8  66.45,43.4 270 top
R9  75.31,43.4 270 top
R10  84.17,43.4 270 top
R11  123.66,128.62 0 top
R12  119.6,43.4 270 top
R15  17.49,120.87 180 top
R16  79.34,60.55 90 top
R17  79.34,66.39 90 top
RESET  13.94,88.11 0 top
RIGHT  31.84,58.83 0 top
SP1  24.35,130.4 0 bottom
U$1  106.9,63.59 0 bottom
U$2  124.68,97.63 90 bottom
U$4  85.56,41.5 0 bottom
U$6  59.4,64.1 180 bottom
U$7  55.85,97.63 90 bottom
UP  24.22,68.04 0 top

### Tracks (layer width: path | path; a pad name or v marks a point on that pad's centre or on a via)
BAT-
  Bottom 0.508: U$4.BAT- 62.32,67.79 70.58,67.79 U$6.B-
BOOSTPWR_OUT
  Bottom 0.508: U$7.OUT+ 62.96,82.39 88.99,56.36 U$1.J2.1
BUTTON_A  (via drill 0.35)
  Top 0.152: A.P$2 140.43,52.55 134.71,52.55 A.P$1 134.08,52.55 127.09,59.53 127.09,63.98 v120.74,70.33
  Bottom 0.152: v120.74,70.33 120.11,69.69 106.14,69.69 104.87,70.96 U$1.J1.7
BUTTON_B  (via drill 0.35)
  Top 0.152: 139.16,67.79 144.87,67.79 B.P$2 | 139.16,67.79 130.27,67.79 125.19,72.87 v118.2,72.87 | 139.16,67.79 B.P$1
  Bottom 0.152: v118.2,72.87 103.6,72.87 102.33,71.6 U$1.J1.6
BUTTON_DOWN
  Top 0.152: DOWN.P$1 21.68,50.01 26.76,50.01 DOWN.P$2 27.4,50.01 60.42,50.01 66.13,55.72 71.85,55.72 71.85,58.26 71.21,58.9 69.94,58.9 69.31,59.53 69.31,61.44 77.56,69.69 106.14,69.69 107.41,70.96 U$1.J1.8
BUTTON_LEFT
  Top 0.152: LEFT.P$1 14.06,60.8 19.14,60.8 LEFT.P$2
BUTTON_RIGHT
  Top 0.152: RIGHT.P$1 29.3,60.8 34.38,60.8 RIGHT.P$2
BUTTON_UP  (via drill 0.35)
  Top 0.152: UP.P$1 21.68,69.69 26.76,69.69 UP.P$2 27.4,69.69 43.91,69.69 54.7,80.49 v67.4,80.49
  Bottom 0.152: v67.4,80.49 90.26,80.49 99.15,71.6 U$1.J1.5
GND  (via drill 0.35)
  other vias: 65.5,50.01 74.39,50.01 85.18,50.01 92.17,50.01 100.42,50.01 122.65,98.9
  pour Top: -5.88,246.47 -5.88,-5.11 157.95,-5.11 157.95,246.47
  pour Bottom: -3.21,244.19 -3.21,-3.21 155.41,-3.21 155.41,244.19
LED1  (via drill 0.35)
  Top 0.152: v95.98,60.8 88.36,60.8 82.64,55.09 66.13,55.09 55.97,44.93 48.99,44.93 R6.1
  Bottom 0.152: v95.98,60.8 95.98,63.98 102.96,70.96 102.96,71.6 103.6,72.23 118.84,72.23 119.47,71.6 U$1.J1.13
LED1W
  Top 0.152: LED1.A 48.99,39.21 48.99,42.39 R6.2
LED1W1
  Top 0.152: LED6.A 92.8,39.21 92.8,42.39 R3.2
LED2  (via drill 0.35)
  Top 0.152: v94.71,60.17 88.36,60.17 82.64,54.45 74.39,54.45 64.86,44.93 57.88,44.93 R7.1
  Bottom 0.152: v94.71,60.17 94.71,65.25 100.42,70.96 100.42,71.6 102.33,73.5 120.11,73.5 122.01,71.6 U$1.J1.14
LED2W
  Top 0.152: LED2.A 57.88,39.21 57.88,42.39 R7.2
LED2W1
  Top 0.152: LED7.A 101.69,39.21 101.69,42.39 R4.2
LED3  (via drill 0.35)
  Top 0.152: v119.47,67.79 108.04,56.36 108.04,55.72 106.77,54.45 83.28,54.45 73.75,44.93 66.77,44.93 R8.1 | v124.55,67.79 124.55,70.96 U$1.J1.15
  Bottom 0.152: v124.55,67.79 v119.47,67.79
LED3W
  Top 0.152: LED3.A 66.77,39.21 66.77,42.39 R8.2
LED3W1
  Top 0.152: LED8.A 110.58,39.21 110.58,42.39 R5.2
LED3W2
  Top 0.152: LED9.A 119.47,39.21 119.47,42.39 R12.2
LED4
  Top 0.152: R9.1 75.66,44.93 82.64,44.93 91.53,53.82 108.04,53.82 109.95,55.72 U$1.J2.9
LED4W
  Top 0.152: LED4.A 75.66,39.21 75.66,42.39 R9.2
LED5
  Top 0.152: R10.1 84.55,44.93 91.53,44.93 99.79,53.18 108.04,53.18 110.58,55.72 111.85,55.72 U$1.J2.10
LED5W
  Top 0.152: LED5.A 83.91,39.21 83.91,42.39 R10.2
LED6
  Top 0.152: R3.1 93.44,44.93 100.42,44.93 109.95,54.45 113.76,54.45 115.03,55.72 U$1.J2.11
LED7
  Top 0.152: R4.1 102.33,44.93 106.77,44.93 117.57,55.72 U$1.J2.12
LED8
  Top 0.152: R5.1 111.22,44.93 120.74,54.45 123.92,54.45 125.19,55.72 U$1.J2.15
LED9
  Top 0.152: R12.1 120.11,44.93 126.46,51.28 126.46,62.07 117.57,70.96 U$1.J1.12
LIGHT_SENSOR  (via drill 0.35)
  Top 0.152: PH1.1 15.33,111.6 14.06,110.33 14.06,101.44 R2.2 13.43,100.81 v14.7,99.54
  Bottom 0.152: v14.7,99.54 14.7,85.57 31.21,69.06 71.85,69.06 86.45,54.45 97.25,54.45 98.52,55.72 99.15,55.72 U$1.J2.5
N$3  (via drill 0.35)
  Top 0.152: v124.55,137.64 124.55,128.63 R11.2
  Bottom 0.152: v124.55,137.64 124.55,179.55 129.25,184.24 129.25,199.87 127.85,201.26 122.99,201.26 NEO9.4
N$6
  Top 0.152: R15.2 16.6,121.13 16.6,126.21 20.41,130.02 SP1.2
N$8
  Top 0.152: NEO4.2 83.91,135.73 85.18,135.73 87.09,137.64 95.34,137.64 96.61,138.91 NEO5.4
N$12
  Top 0.152: R1.2 61.05,135.1 58.51,135.1 55.34,138.27 55.34,143.35 55.97,143.99 58.51,143.99 60.42,142.08 NEO1.4
N$18
  Top 0.152: NEO1.2 57.24,138.91 58.51,138.91 59.78,137.64 63.59,137.64 65.5,139.54 68.67,139.54 69.94,140.81 NEO2.4
N$20
  Top 0.152: NEO2.2 66.13,137.64 67.4,137.64 69.31,139.54 71.85,139.54 73.75,141.45 76.29,141.45 78.2,139.54 NEO3.4
N$21
  Top 0.152: NEO3.2 75.02,136.37 76.29,136.37 77.56,135.1 80.74,135.1 83.28,137.64 86.45,137.64 87.72,138.91 NEO4.4
N$23
  Top 0.152: NEO5.2 92.8,135.73 94.07,135.73 95.98,137.64 102.96,137.64 105.5,140.18 NEO6.4
N$24
  Top 0.152: NEO6.2 102.33,137 102.96,137 104.23,138.27 109.31,138.27 110.58,139.54 113.12,139.54 114.39,140.81 NEO7.4
N$25
  Top 0.152: NEO7.2 111.22,137.64 111.85,137.64 114.39,140.18 120.74,140.18 123.28,142.72 NEO8.4
N$27
  Bottom 0.152: 69.59,200.04 71.21,203.04 113.63,203.04 121.2,195.47 122.86,195.47 NEO9.2 | 69.59,200.04 | 69.59,200.04 61.64,200.04 61.56,200.12 61.43,200.12 58.81,197.49 NEO10.4
NEOPIXEL1_OUT
  Top 0.152: R1.1 61.05,126.21 109.31,77.95 109.31,71.6 U$1.J1.9
NEOPIXEL2_OUT
  Top 0.152: R11.1 122.65,128.56 122.65,117.95 124.55,116.05 124.55,82.39 122.01,79.85 122.01,79.22 117.57,74.77 113.12,74.77 113.12,72.23 112.49,71.6 U$1.J1.10
PIEZO  (via drill 0.35)
  Top 0.152: v67.4,84.3 57.24,84.3 47.72,74.77 26.76,74.77 18.51,83.03 18.51,120.49 R15.1 | v113.76,74.14 113.76,72.23 114.39,71.6 U$1.J1.11
  Bottom 0.152: v67.4,84.3 103.6,84.3 v113.76,74.14
RST  (via drill 0.35)
  Top 0.152: 15.33,90.01 16.6,90.01 RESET.P$2 | 15.33,90.01 10.89,90.01 RESET.P$1 | 15.33,90.01 15.33,85.57 26.76,74.14 47.72,74.14 54.7,81.12 v65.5,81.12
  Bottom 0.152: v65.5,81.12 76.93,69.69 93.44,69.69 94.07,70.33 | 94.07,70.33 94.71,70.96 U$1.J1.3 | 94.07,70.33 94.07,56.36 U$1.J2.3
SCL
  Top 0.152: U$2.J1.3 126.46,79.85 126.46,113.51 128.36,115.41 U$2.J2.1
  Bottom 0.152: U$1.J2.7 104.87,56.36 116.93,68.42 125.82,68.42 127.09,69.69 127.09,78.58 125.82,79.85 U$2.J1.3 | OLED.3 113.76,126.84 123.92,116.68 127.73,116.68 129,115.41 U$2.J2.1
SDA  (via drill 0.35)
  Top 0.152: U$1.J2.8 107.41,56.36 115.66,64.61 115.66,71.6 123.92,79.85 U$2.J1.4 | v123.92,117.95 126.46,115.41 U$2.J2.2
  Bottom 0.152: OLED.4 112.49,129.38 v123.92,117.95 | U$2.J1.4 123.92,79.85 123.92,112.87 126.46,115.41 U$2.J2.2
VBAT
  Top 0.508: R16.1 78.83,59.53 72.48,59.53 71.21,60.8 U$6.B+
  Bottom 0.508: U$4.BAT+ 125.82,48.1 83.91,48.1 71.21,60.8 U$6.B+
VBAT_SENSE
  Top 0.152: R17.1 79.47,65.25 79.47,62.07 R16.2 79.47,61.44 97.25,61.44 102.33,56.36 U$1.J2.6
VBATOUT
  Top 0.508: BATTERY_ON_OFF.P$3 61.69,123.67 68.67,116.68 68.67,58.9 70.58,56.99 U$6.OUT+
VBOOST_IN
  Top 0.508: BATTERY_ON_OFF.P$2 59.15,123.67 59.15,112.87 U$7.IN+
VCC  (via drill 0.35)
  Top 0.508: OLED.2 68.67,130.02 | 68.67,130.02 67.4,131.29 67.4,132.56 C1.2 | 123.28,115.41 120.74,117.95 v120.74,132.56 120.74,133.83 C2.2 | 111.85,141.45 111.22,141.45 NEO7.1 110.58,140.81 107.41,140.81 106.77,141.45 104.23,141.45 102.33,139.54 NEO6.1 101.69,140.18 91.53,140.18 | 111.85,141.45 113.12,142.72 119.47,142.72 NEO8.1 | NEO1.1 57.24,142.08 58.51,140.81 v63.59,140.81 65.5,140.81 NEO2.1 66.13,141.45 67.4,142.72 78.83,142.72 83.28,138.27 | 83.91,138.91 85.82,140.81 90.9,140.81 91.53,140.18 | 91.53,140.18 92.8,138.91 NEO5.1 | 75.02,139.54 76.29,138.27 83.28,138.27 | 83.91,138.91 83.28,138.27 | 83.91,138.91 NEO4.1 | 111.85,141.45 v112.49,140.81 | 123.28,115.41 121.38,113.51 121.38,79.85 U$2.J1.5 | 123.28,115.41 U$2.J2.3 | 68.67,130.02 72.48,133.83 72.48,137 75.02,139.54 | 75.02,139.54 NEO3.1
  Bottom 0.508: OLED.2 73.75,124.3 72.48,123.03 72.48,118.59 28.67,74.77 26.76,74.77 23.21,78.33 23.21,92.3 12.79,102.71 12.79,111.6 PH1.2 | U$1.J2.4 97.25,56.36 109.95,69.06 125.19,69.06 126.46,70.33 126.46,74.14 120.74,79.85 U$2.J1.5 | v112.49,140.81 v120.74,132.56 | v63.59,140.81 63.59,147.8 54.07,157.32 54.07,198.21 56.35,200.5 59.05,200.5 NEO10.1 67.99,204.95 116.17,204.95 123.11,198 NEO9.1

### Text on the board
204bmp: Teal and grey colors and whiskers on kittens, / The chemistry between Apex heros and villains, / Hi-Chew, Brand New, and Sudoku playing, / These are a few of my favorite things. | FOR DESCRIPTION AND ASSEMBLY INSTRUCTIONS: | https://github.com/MakeItHackin/SecretSanta2020 | THIS PROJECT IS HACKABLE. DO SOMETHING FUN WITH IT !!! | DESIGNED BY: ANDREW DENIO @MakeItHackin | NEOPIXEL WS2812 5050 LEDS | PIEZO / / BUZZER | 128 X 32 OLED DISPLAY | LIGHT / SENSOR | REAL TIME CLOCK DS3231 | DC POWER BOOST MODULE | BATTERY CHARGER | ARDUINO NANO v3.0 | 3.7v 18650 BATTERY | NEG | POS | DESIGNED FOR THE REDDIT GIFT 2020 SECRET SANTA EXCHANGE | DECEMBER 8, 2020 - MY FIRST REDDIT GIFT EXCHANGE | TRADEMARKS AND COPYRIGHT USED WITH ARTISTIC LICENSE. NOT FOR SALE